# EAGLE design SLAMStruderBrd (EAGLE 7.3.0)
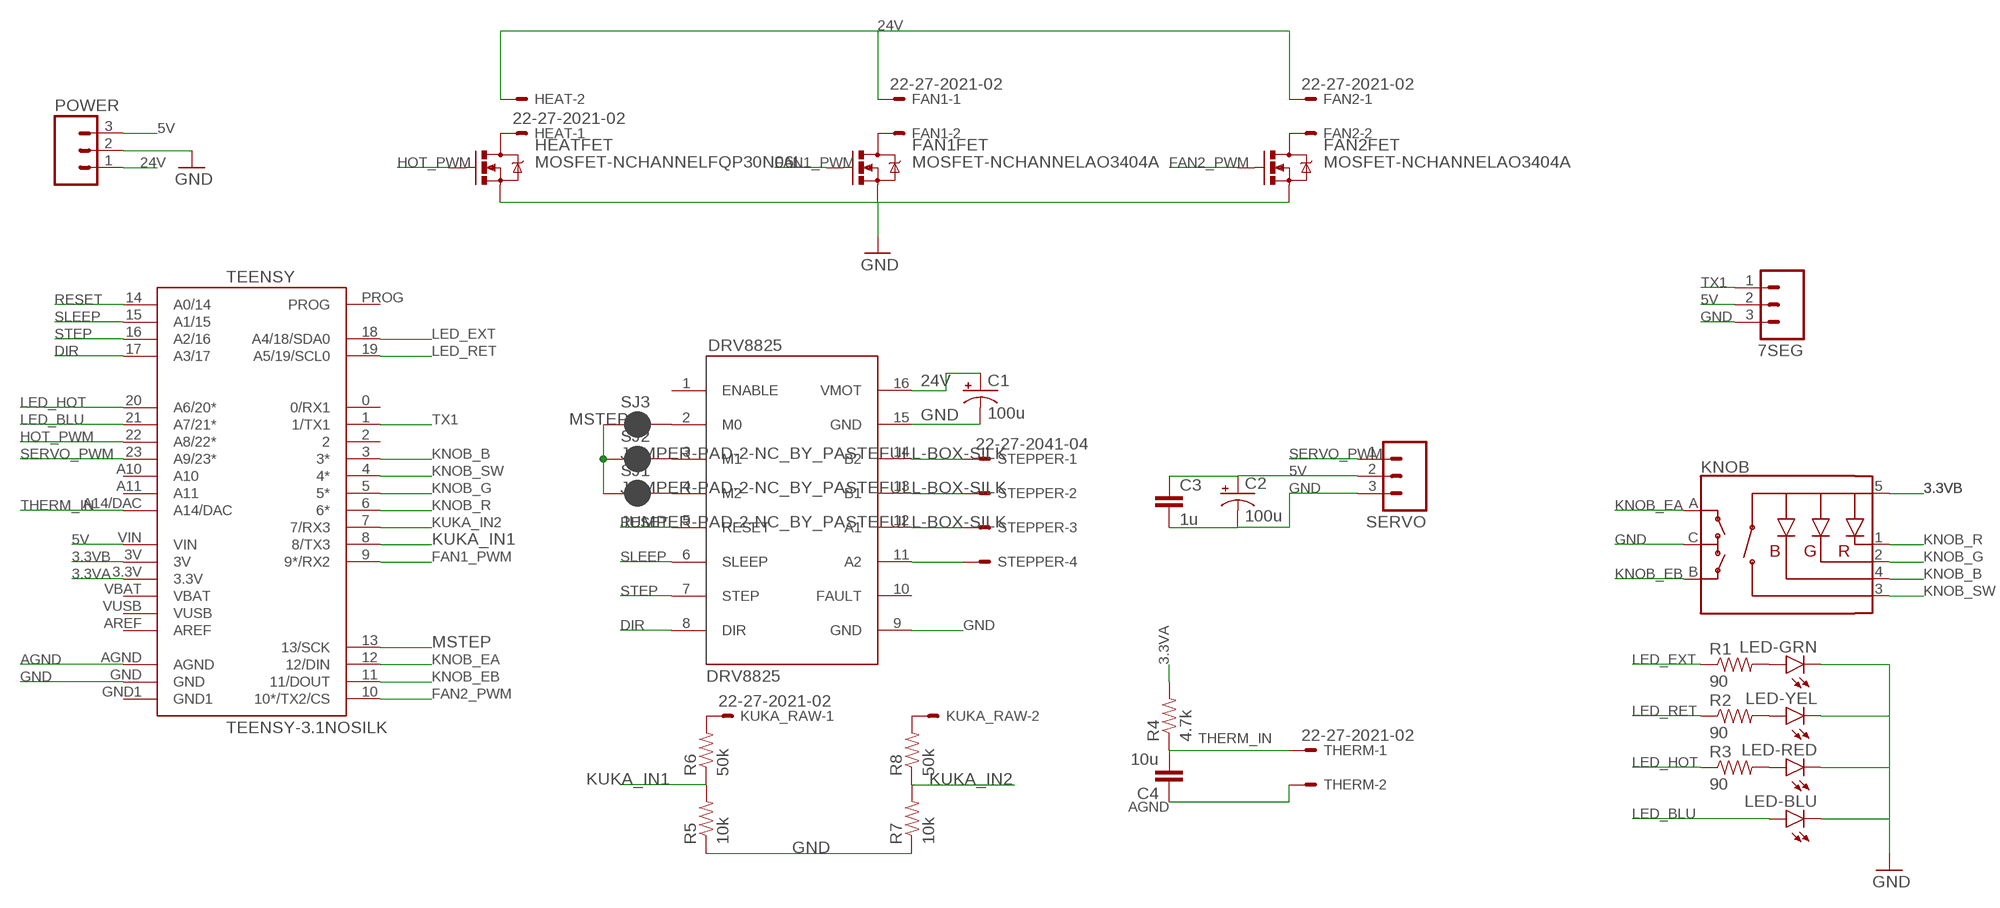
[diagram p0: schematic, sheet 1]

## Parts
7SEG  M031X03_NO_SILK  [1X03_NO_SILK]
C1  100u  CAP_POLE  [PANASONIC_E]
C2  100u  CAP_POLE  [PANASONIC_E]
C3  1u  CAP0805  [0805]
C4  10u  CAP0805  [0805]
DRV8825  DRV8825  [STEPPER_DRIVER]
FAN1  22-27-2021-02  [6410-02]
FAN1FET  MOSFET-NCHANNELAO3404A  [SOT23-3]
FAN2  22-27-2021-02  [6410-02]
FAN2FET  MOSFET-NCHANNELAO3404A  [SOT23-3]
HEAT  22-27-2021-02  [6410-02]
HEATFET  MOSFET-NCHANNELFQP30N06L  [TO220V]
KNOB  ENCODER_RGB_CA  [ENCODER_LED_3]
KUKA_RAW  22-27-2021-02  [6410-02]
LED-BLU  LED5MM  [LED5MM]
LED-GRN  LED5MM  [LED5MM]
LED-RED  LED5MM  [LED5MM]
LED-YEL  LED5MM  [LED5MM]
POWER  M03SCREW  [SCREWTERMINAL-3.5MM-3]
R1  90  RESISTOR0805-RES  [0805]
R2  90  RESISTOR0805-RES  [0805]
R3  90  RESISTOR0805-RES  [0805]
R4  4.7k  RESISTOR0805-RES  [0805]
R5  10k  RESISTOR0805-RES  [0805]
R6  50k  RESISTOR0805-RES  [0805]
R7  10k  RESISTOR0805-RES  [0805]
R8  50k  RESISTOR0805-RES  [0805]
SERVO  M03PTH  [1X03]
SJ1  JUMPER-PAD-2-NC_BY_PASTEFULL-BOX-SILK  [PAD-JUMPER-2-NC_BY_PASTE_YES_SILK_FULL_BOX]
SJ2  JUMPER-PAD-2-NC_BY_PASTEFULL-BOX-SILK  [PAD-JUMPER-2-NC_BY_PASTE_YES_SILK_FULL_BOX]
SJ3  JUMPER-PAD-2-NC_BY_PASTEFULL-BOX-SILK  [PAD-JUMPER-2-NC_BY_PASTE_YES_SILK_FULL_BOX]
STEPPER  22-27-2041-04  [6410-04]
TEENSY  TEENSY-3.1NOSILK  [TEENSY-3.1_NOSILK]
THERM  22-27-2021-02  [6410-02]

## Nets
3.3VA: R4.2 TEENSY.3.3V
3.3VB: KNOB.5(+) TEENSY.3V
5V: 7SEG.2 C2.+ C3.1 POWER.3 SERVO.2 TEENSY.VIN
24V: C1.+ DRV8825.16(VMOT) FAN1.1 FAN2.1 HEAT.2 POWER.1
AGND: C4.1 TEENSY.AGND THERM.2
DIR: DRV8825.8(DIR) TEENSY.17(A3/17)
FAN1_PWM: FAN1FET.1(G) TEENSY.9(9*/RX2)
FAN2_PWM: FAN2FET.1(G) TEENSY.10(10*/TX2/CS)
GND: 7SEG.3 C1.- C2.- C3.2 DRV8825.9(GND) DRV8825.15(GND) FAN1FET.2(S) FAN2FET.2(S) HEATFET.3(S) KNOB.C LED-BLU.K(C) LED-GRN.K(C) LED-RED.K(C) LED-YEL.K(C) POWER.2 R5.1 R7.1 SERVO.3 TEENSY.GND
HOT_PWM: HEATFET.1(G) TEENSY.22(A8/22*)
KNOB_B: KNOB.4(-B) TEENSY.3(3*)
KNOB_EA: KNOB.A TEENSY.12(12/DIN)
KNOB_EB: KNOB.B TEENSY.11(11/DOUT)
KNOB_G: KNOB.2(-G) TEENSY.5(5*)
KNOB_R: KNOB.1(-R) TEENSY.6(6*)
KNOB_SW: KNOB.3(SW) TEENSY.4(4*)
KUKA_IN1: R5.2 R6.1 TEENSY.8(8/TX3)
KUKA_IN2: R7.2 R8.1 TEENSY.7(7/RX3)
LED_BLU: LED-BLU.A TEENSY.21(A7/21*)
LED_EXT: R1.1 TEENSY.18(A4/18/SDA0)
LED_HOT: R3.1 TEENSY.20(A6/20*)
LED_RET: R2.1 TEENSY.19(A5/19/SCL0)
MSTEP: SJ1.1 SJ2.1 SJ3.1 TEENSY.13(13/SCK)
N$1: DRV8825.14(B2) STEPPER.1
N$2: DRV8825.13(B1) STEPPER.2
N$3: HEAT.1 HEATFET.2(D)
N$4: DRV8825.11(A2) STEPPER.4
N$5: DRV8825.12(A1) STEPPER.3
N$6: FAN1.2 FAN1FET.3(D)
N$7: FAN2.2 FAN2FET.3(D)
N$8: LED-GRN.A R1.2
N$9: LED-YEL.A R2.2
N$10: LED-RED.A R3.2
N$11: DRV8825.4(M2) SJ1.2
N$12: DRV8825.3(M1) SJ2.2
N$13: DRV8825.2(M0) SJ3.2
N$14: KUKA_RAW.1 R6.2
N$15: KUKA_RAW.2 R8.2
RESET: DRV8825.5(RESET) TEENSY.14(A0/14)
SERVO_PWM: SERVO.1 TEENSY.23(A9/23*)
SLEEP: DRV8825.6(SLEEP) TEENSY.15(A1/15)
STEP: DRV8825.7(STEP) TEENSY.16(A2/16)
THERM_IN: C4.2 R4.1 TEENSY.A14/DAC THERM.1
TX1: 7SEG.1 TEENSY.1(1/TX1)
Unconnected: DRV8825.1(ENABLE) DRV8825.10(FAULT) TEENSY.0(0/RX1) TEENSY.2 TEENSY.A10 TEENSY.A11 TEENSY.AREF TEENSY.GND1 TEENSY.PROG TEENSY.VBAT TEENSY.VUSB

## Library data of the parts
7SEG SERVO = SparkFun-Connectors:M03: Header 3 Standard 3-pin 0.1" header. Use with straight break away headers (SKU : PRT-00116), right angle break away headers (PRT-00553), swiss pins (PRT-00743), machine pins (PRT-00117), and female headers (PRT-00115). Molex polarized connector foot print use with SKU : PRT-08232 with associated crimp pins and housings.
C1 C2 = SparkFun-Passives:CAP_POL: Capacitor Polarized These are standard SMD and PTH capacitors. Normally 10uF, 47uF, and 100uF in electrolytic and tantalum varieties. Always verify the external diameter of the through hole cap, it varies with capacity, voltage, and manufacturer. The EIA devices should be standard.
C3 C4 = SparkFun-Passives:CAP: Capacitor Standard 0603 ceramic capacitor, and 0.1" leaded capacitor.
DRV8825 = pololu:DRV8825
FAN1 FAN2 HEAT KUKA_RAW THERM = con-molex:22-?-02: CONNECTOR wire to board 2.54 mm (.1 inch) pitch header; OC_FARNELL: unknown; OC_NEWARK: unknown
FAN1FET FAN2FET = SparkFun-DiscreteSemi:MOSFET-NCHANNEL: Common NMOSFET Parts MFG P/N Store ID Prod ID FDD8780 TRANS-09984 SI7820DN TRANS-11055 FDS6630A IC-08089 2N7002PW TRANS-11151 FQP30N06L COM-10213 TRANS-10060 BSS123LT1G TRANS-08345 BSS138 TRANS-00830 BS170 2N7000; PROD_ID: TRAN-12988
HEATFET = SparkFun-DiscreteSemi:MOSFET-NCHANNEL: Common NMOSFET Parts MFG P/N Store ID Prod ID FDD8780 TRANS-09984 SI7820DN TRANS-11055 FDS6630A IC-08089 2N7002PW TRANS-11151 FQP30N06L COM-10213 TRANS-10060 BSS123LT1G TRANS-08345 BSS138 TRANS-00830 BS170 2N7000; PROD_ID: TRANS-10060
KNOB = SparkFun-Electromechanical:ENCODER_RGB_CA: Illuminated Rotary Encoder w/ RGB LED and select switch EC12PLRGBSDVBF-D: http://top-up.so-buy.com/front/bin/ptdetail.phtml?Part=EC12PLRGBSDVBF-D
LED-BLU LED-GRN LED-RED LED-YEL = SparkFun-LED:LED: LEDs Standard schematic elements and footprints for 5mm, 3mm, 1206, and 0603 sized LEDs. 5mm - Spark Fun Electronics SKU : COM-00529 (and others)
POWER = SparkFun-Connectors:M03: Header 3 Standard 3-pin 0.1" header. Use with straight break away headers (SKU : PRT-00116), right angle break away headers (PRT-00553), swiss pins (PRT-00743), machine pins (PRT-00117), and female headers (PRT-00115). Molex polarized connector foot print use with SKU : PRT-08232 with associated crimp pins and housings.; PROD_ID: CONN-08288
R1-R8 = SparkFun-Passives:RESISTOR: Resistor Basic schematic elements and footprints for 0603, 1206, and PTH resistors.
SJ1-SJ3 = SparkFun-Passives:JUMPER-PAD-2-NC_BY_PASTE
STEPPER = con-molex:22-?-04: CONNECTOR wire to board 2.54 mm (.1 inch) pitch header; OC_FARNELL: unknown; OC_NEWARK: unknown
TEENSY = SparkFun-Boards:TEENSY-3.1; SF_ID: DEV-12646

## Board
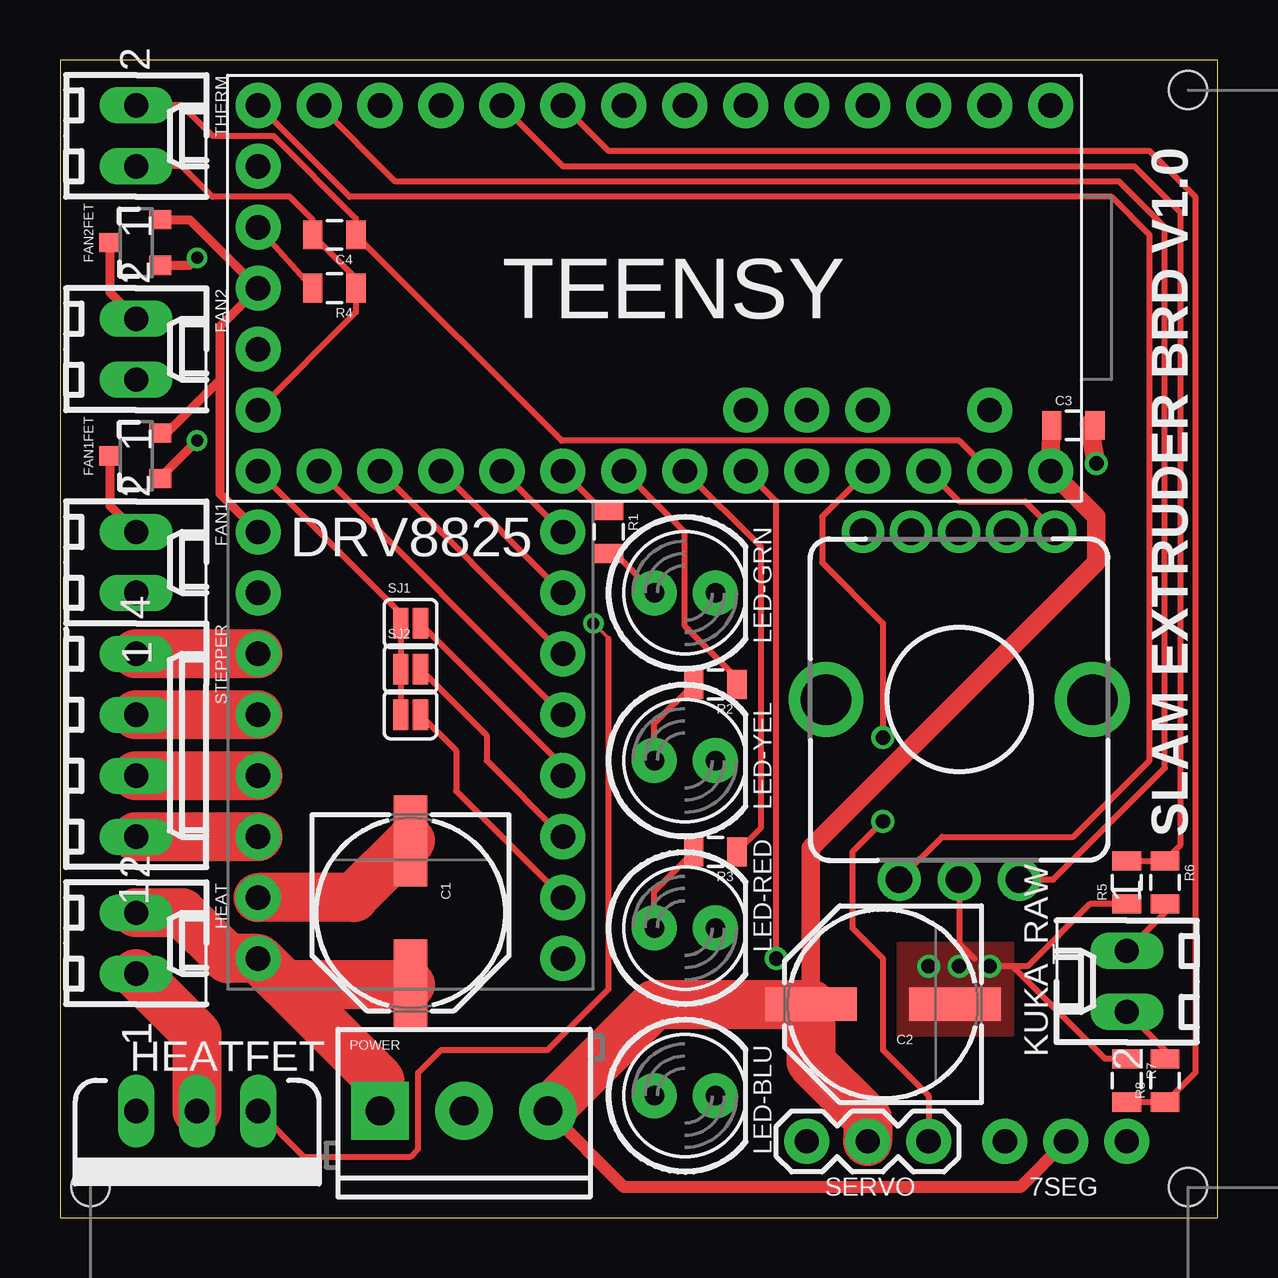
[diagram p1: board, top side]
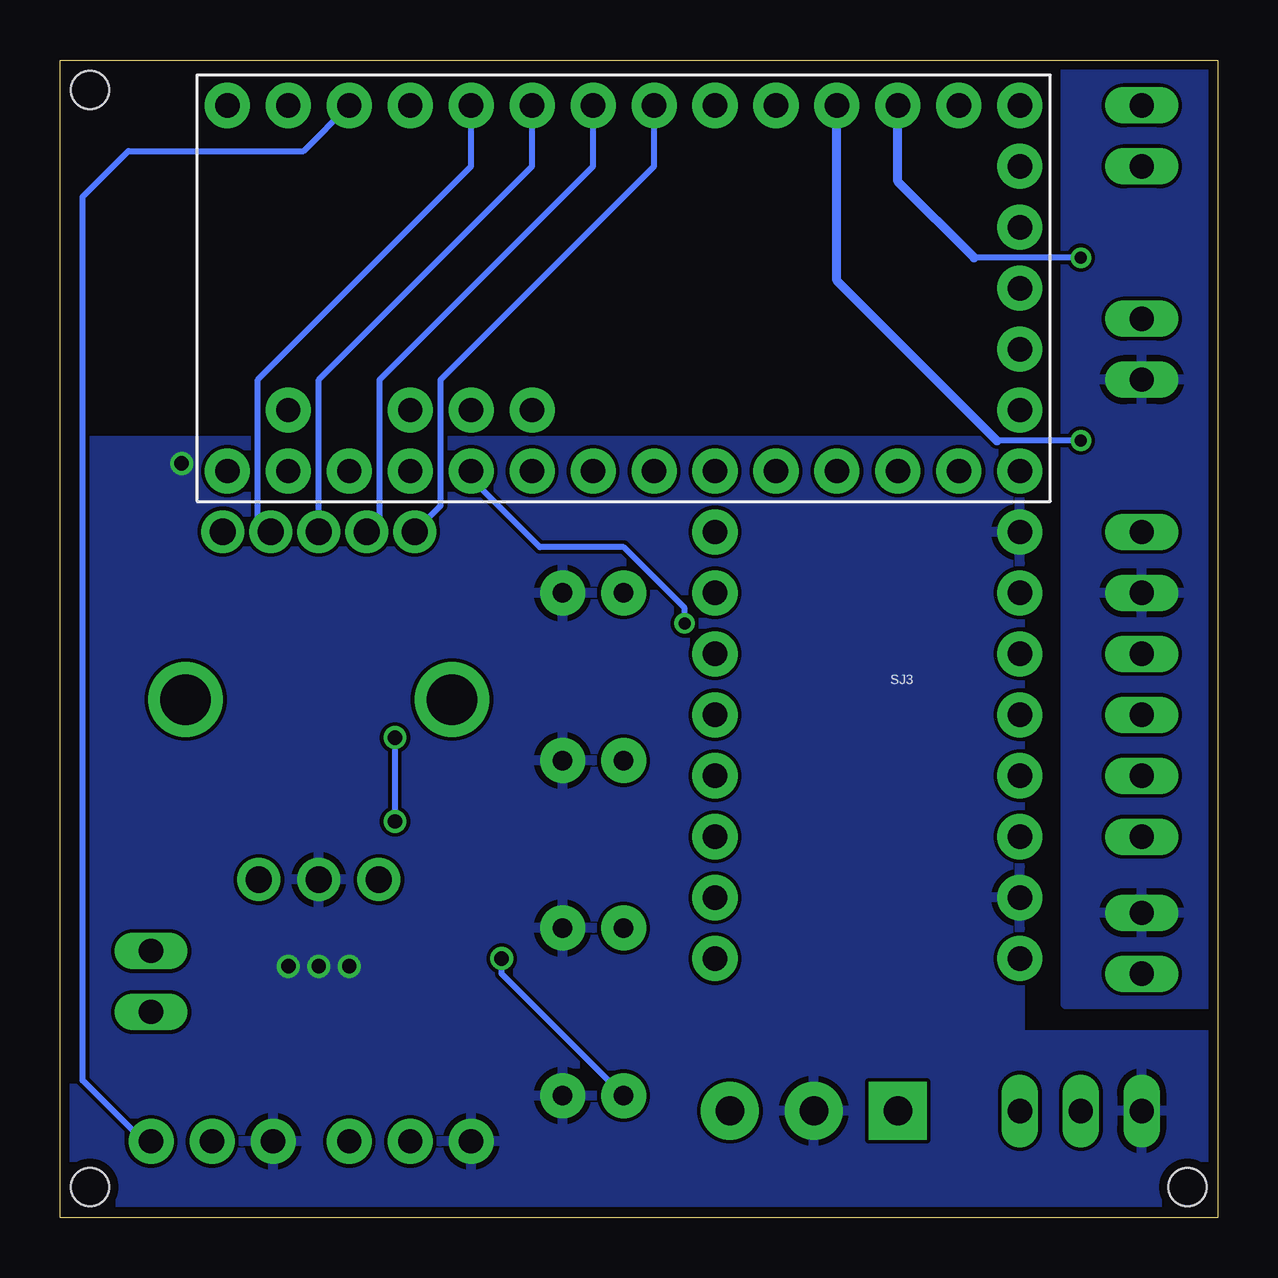
[diagram p2: board, bottom side, seen from below]

Size 48.25 x 48.25 mm. Coordinates in mm from the lower left corner, seen from the top.
Outline: 0,0 48.25,0 48.25,48.25 0,48.25 0,0
Copper layers (1*16): Top 0.0356mm / dielectric 1.5011mm / Bottom 0.0356mm
Design rules "LaenPCBOrder": minimum track width 6mil, minimum drill 13mil, track to track 6mil, track to pad 6mil, pad to pad 6mil, via to via 6mil, smd to smd 6mil, copper to edge 15mil, drill to drill 6mil, minimum pad ring 7mil, minimum via ring 7mil, stop-mask expansion 3mil, vias tented up to drill 0mil, thermal gap 10mil
Holes 1.59 mm at 1.27,1.27 46.99,1.27 46.99,46.99

### Footprints (pad centres in the part's own frame; a part is rotated, then mirrored left to right if it is on the bottom)
1X03_NO_SILK = drill 1.016 pad 1.88: 1 0,0; 2 2.54,0; 3 5.08,0
PANASONIC_E = smd 3.8 x 1.4: + 3,0; - -3,0
0805 = smd 0.8 x 1.2: 1 -0.9,0; 2 0.9,0
STEPPER_DRIVER = drill 1.016 pad 1.88: 1 -6.35,8.89; 2 -6.35,6.35; 3 -6.35,3.81; 4 -6.35,1.27; 5 -6.35,-1.27; 6 -6.35,-3.81; 7 -6.35,-6.35; 8 -6.35,-8.89; 9 6.35,-8.89; 10 6.35,-6.35; 11 6.35,-3.81; 12 6.35,-1.27; 13 6.35,1.27; 14 6.35,3.81; 15 6.35,6.35; 16 6.35,8.89
6410-02 = drill 1.016 long: 1 1.27,0; 2 -1.27,0
SOT23-3 = smd 0.8 x 0.9: 1 -0.95,-1; 2 0.95,-1; 3 0,1.1
TO220V = drill 1.016 long: 1 -2.54,0; 2 0,0; 3 2.54,0
ENCODER_LED_3 = drill 1.1 pad 1.778: 1 -4,7; 2 -2,7; 3 0,7; 4 2,7; 5 4,7 | drill 1.1 pad 1.8: A -2.5,-7.5; B 2.5,-7.5; C 0,-7.5 | drill 2.1: M1 -5.55,0; M2 5.55,0
LED5MM = drill 0.813 pad 1.88: A -1.27,0; K 1.27,0
SCREWTERMINAL-3.5MM-3 = drill 1.2 pad 2.413 square: 1 0,0 | drill 1.2 pad 2.413: 2 3.5,0; 3 7,0
1X03 = drill 1.016 pad 1.88: 1 0,0; 2 2.54,0; 3 5.08,0
PAD-JUMPER-2-NC_BY_PASTE_YES_SILK_FULL_BOX = smd 0.635 x 1.27: 1 -0.412,0; 2 0.412,0
6410-04 = drill 1.016 long: 1 3.81,0; 2 1.27,0; 3 -1.27,0; 4 -3.81,0
TEENSY-3.1_NOSILK = drill 1.016 pad 1.88: 0 16.51,3.81; 1 16.51,6.35; 2 16.51,8.89; 3 16.51,11.43; 3.3V 11.43,34.29; 3V 1.27,6.35; 4 16.51,13.97; 5 16.51,16.51; 6 16.51,19.05; 7 16.51,21.59; 8 16.51,24.13; 9 16.51,26.67; 10 16.51,29.21; 11 16.51,31.75; 12 16.51,34.29; 13 1.27,34.29; 14 1.27,31.75; 15 1.27,29.21; 16 1.27,26.67; 17 1.27,24.13; 18 1.27,21.59; 19 1.27,19.05; 20 1.27,16.51; 21 1.27,13.97; 22 1.27,11.43; 23 1.27,8.89; A10 3.81,11.43; A11 3.81,13.97; A14/DAC 3.81,34.29; AGND 1.27,3.81; AREF 3.81,8.89; GND 8.89,34.29; GND1 16.51,1.27; PROG 6.35,34.29; VBAT 13.97,34.29; VIN 1.27,1.27; VUSB 3.81,3.81

### Placement (x,y rotation side)
7SEG  44.45,3.17 180 top
C1  14.61,12.7 270 top
C2  34.29,8.89 180 top
C3  42.23,33.02 0 top
C4  11.43,40.96 180 top
DRV8825  14.61,19.69 180 top
FAN1  3.17,27.3 270 top
FAN1FET  3.17,31.75 90 top
FAN2  3.17,36.2 270 top
FAN2FET  3.17,40.64 90 top
HEAT  3.17,11.43 270 top
HEATFET  5.71,4.45 180 top
KNOB  37.47,21.59 0 top
KUKA_RAW  44.45,9.84 90 top
LED-BLU  26.04,5.08 0 top
LED-GRN  26.04,26.04 0 top
LED-RED  26.04,12.06 0 top
LED-YEL  26.04,19.05 0 top
POWER  13.34,4.45 0 top
R1  22.86,28.58 270 top
R2  27.3,22.23 180 top
R3  27.3,15.24 180 top
R4  11.43,38.73 180 top
R5  44.45,13.97 90 top
R6  46.04,13.97 270 top
R7  44.45,5.71 270 top
R8  46.04,5.71 90 top
SERVO  36.2,3.17 180 top
SJ1  14.61,24.77 0 top
SJ2  14.61,22.86 0 top
SJ3  14.61,20.96 0 top
STEPPER  3.17,19.69 270 top
TEENSY  42.55,29.85 90 top
THERM  3.17,45.09 270 top

### Tracks (layer width: path | path; a pad name or v marks a point on that pad's centre or on a via)
3.3VA
  Top 0.254: TEENSY.3.3V R4.2
3.3VB
  Top 0.254: TEENSY.3V 37.47,29.85 40.21,29.85 KNOB.5
5V
  Top 0.508: 7SEG.2 40.01,1.27 23.51,1.27 POWER.3
  Top 0.762: C3.1 41.27,32.12 TEENSY.VIN 43.18,29.21 43.18,27.3 31.29,15.41 C2.+
  Top 2.032: POWER.3 24.78,8.89 C2.+ 31.29,6.49 33.66,4.13 SERVO.2
24V
  Top 2.032: DRV8825.16 6.99,10.79 5.08,12.7 HEAT.2 | C1.+ 9.35,9.7 DRV8825.16 | POWER.1 13.34,5.71 DRV8825.16
  pour Bottom: 0,8.89 6.35,8.89 6.35,48.26 0,48.26
AGND
  Top 0.152: 12.33,41.65 C4.1
  Top 0.254: THERM.2 5.08,46.36 6.35,45.09 8.89,45.09 12.33,41.65 | TEENSY.AGND 37.47,32.38 20.9,32.38 C4.1
DIR
  Top 0.254: DRV8825.8 TEENSY.17
FAN1_PWM  (via drill 0.5)
  Top 0.381: FAN1FET.1 4.17,30.85 v5.71,32.38
  Bottom 0.254: v5.71,32.38 9.21,32.38
  Bottom 0.381: 9.21,32.38 15.88,39.05 TEENSY.9
FAN2_PWM  (via drill 0.5)
  Top 0.381: FAN2FET.1 5.4,39.69 v5.71,40.01
  Bottom 0.254: v5.71,40.01 10.16,40.01
  Bottom 0.381: 10.16,40.01 13.34,43.18 TEENSY.10
GND  (via drill 0.6)
  Top 0.254: C3.2 42.86,33.07 | R5.1 42.91,13.07 40.32,10.48 39.69,10.48 | 39.69,10.48 v38.73,10.48 | R7.1 43.55,6.62 39.69,10.48 | KNOB.C 37.47,11.43 38.1,10.79
  Top 0.381: FAN2FET.2 5.4,41.59 TEENSY.GND 6.67,37.15 6.67,34.93 | v37.47,10.48 37.29,10.3 | DRV8825.9 6.67,30.16 6.67,34.93 | FAN1FET.2 4.44,32.7 6.67,34.93
  Top 0.762: 42.86,33.07 v43.18,31.43
  Top 2.032: C1.- 12.24,13.33 DRV8825.15
  other vias: 36.2,10.48
  pour Bottom: 47.62,0.64 47.62,32.38 8.26,32.38 8.26,7.62 0,7.62 0,0.64
  pour Top (no thermals): 34.92,7.62 39.69,7.62 39.69,11.43 34.92,11.43
HOT_PWM  (via drill 0.5)
  Top 0.152: 22.86,24.13 v22.23,24.77
  Top 0.254: HEATFET.1 10.16,2.54 14.61,2.54 14.92,2.86 14.92,6.03 15.88,6.99 20.32,6.99 22.86,9.53 22.86,24.13
  Bottom 0.254: v22.23,24.77 22.23,25.4 24.77,27.94 28.26,27.94 31.11,30.8 TEENSY.22
KNOB_B
  Bottom 0.152: KNOB.4 40.01,29.13
  Bottom 0.254: 40.01,29.13 40.01,34.93 31.11,43.81 TEENSY.3
KNOB_EA
  Top 0.254: KNOB.A 36.75,15.88 42.23,15.88 45.4,19.05 45.4,40.96 43.81,42.55 12.06,42.55 TEENSY.12
KNOB_EB
  Top 0.254: KNOB.B 41.4,14.09 46.04,18.73 46.04,41.27 44.13,43.18 13.97,43.18 TEENSY.11
KNOB_G
  Bottom 0.152: KNOB.2 34.92,29.13
  Bottom 0.254: 34.92,29.13 34.92,34.93 26.04,43.81 TEENSY.5
KNOB_R
  Bottom 0.254: KNOB.1 32.38,29.67 32.38,34.93 23.5,43.81 TEENSY.6
KNOB_SW
  Bottom 0.254: KNOB.3 37.47,34.93 28.57,43.81 TEENSY.4
KUKA_IN1
  Top 0.254: R5.2 R6.1 46.67,15.5 46.67,41.91 44.77,43.81 20.95,43.81 TEENSY.8
KUKA_IN2
  Top 0.254: R7.2 R8.1 46.09,4.82 47.31,6.03 47.31,42.55 45.4,44.45 22.86,44.45 TEENSY.7
LED_BLU  (via drill 0.6)
  Top 0.254: v29.84,10.79 29.84,29.85 TEENSY.21
  Bottom 0.254: LED-BLU.A 29.84,10.16 v29.84,10.79
LED_EXT
  Top 0.254: R1.1 22.59,29.48 TEENSY.18
LED_HOT
  Top 0.254: R3.1 29.21,16.25 29.21,27.94 TEENSY.20
LED_RET
  Top 0.254: R2.1 28.2,22.49 26.04,24.66 26.04,28.58 TEENSY.19
MSTEP
  Top 0.254: TEENSY.13 14.19,25.18 SJ1.1 SJ2.1 SJ3.1
N$1
  Top 2.032: DRV8825.14 STEPPER.1
N$2
  Top 2.032: DRV8825.13 STEPPER.2
N$3
  Top 2.032: HEATFET.2 5.71,7.62 HEAT.1
N$4
  Top 2.032: DRV8825.11 STEPPER.4
N$5
  Top 2.032: DRV8825.12 STEPPER.3
N$6
  Top 0.381: FAN1FET.3 2.08,29.68 FAN1.2
N$7
  Top 0.381: FAN2FET.3 2.08,38.56 FAN2.2
N$8
  Top 0.254: R1.2 23.12,27.68 LED-GRN.A
N$9
  Top 0.254: LED-YEL.A 24.77,20.59 R2.2
N$10
  Top 0.254: LED-RED.A 24.77,13.6 R3.2
N$11
  Top 0.254: SJ1.2 20.95,18.83 DRV8825.4
N$12
  Top 0.254: SJ2.2 17.78,20.1 17.78,19.05 DRV8825.3
N$13
  Top 0.254: SJ3.2 16.51,19.46 16.51,17.78 DRV8825.2
N$14
  Top 0.254: KUKA_RAW.1 46.04,12.7 R6.2
N$15
  Top 0.254: KUKA_RAW.2 46.04,6.99 R8.2
RESET
  Top 0.254: DRV8825.5 TEENSY.14
SERVO_PWM  (via drill 0.6)
  Top 0.254: TEENSY.23 31.75,29.21 31.75,27.3 34.29,24.77 v34.29,20 | SERVO.1 36.2,5.08 34.29,6.99 34.29,10.79 33.02,12.06 33.02,15.24 v34.29,16.51
  Bottom 0.254: v34.29,20 v34.29,16.51
SLEEP
  Top 0.254: DRV8825.6 TEENSY.15
STEP
  Top 0.254: DRV8825.7 TEENSY.16
THERM_IN
  Top 0.152: C4.2 10.53,41.59
  Top 0.254: TEENSY.A14/DAC 12.33,37.73 R4.1 12.33,39.16 C4.2 | THERM.1 5.08,43.81 6.35,42.55 9.58,42.55 10.53,41.59
TX1
  Bottom 0.152: 7SEG.1 44.77,3.17
  Bottom 0.254: 44.77,3.17 47.31,5.71 47.31,42.55 45.4,44.45 38.1,44.45 TEENSY.1

### Text on the board
tNames: SLAM EXTRUDER BRD V1.0